# Altium project ECE453-F22-MCU.PrjPcb (part 1 of 2)
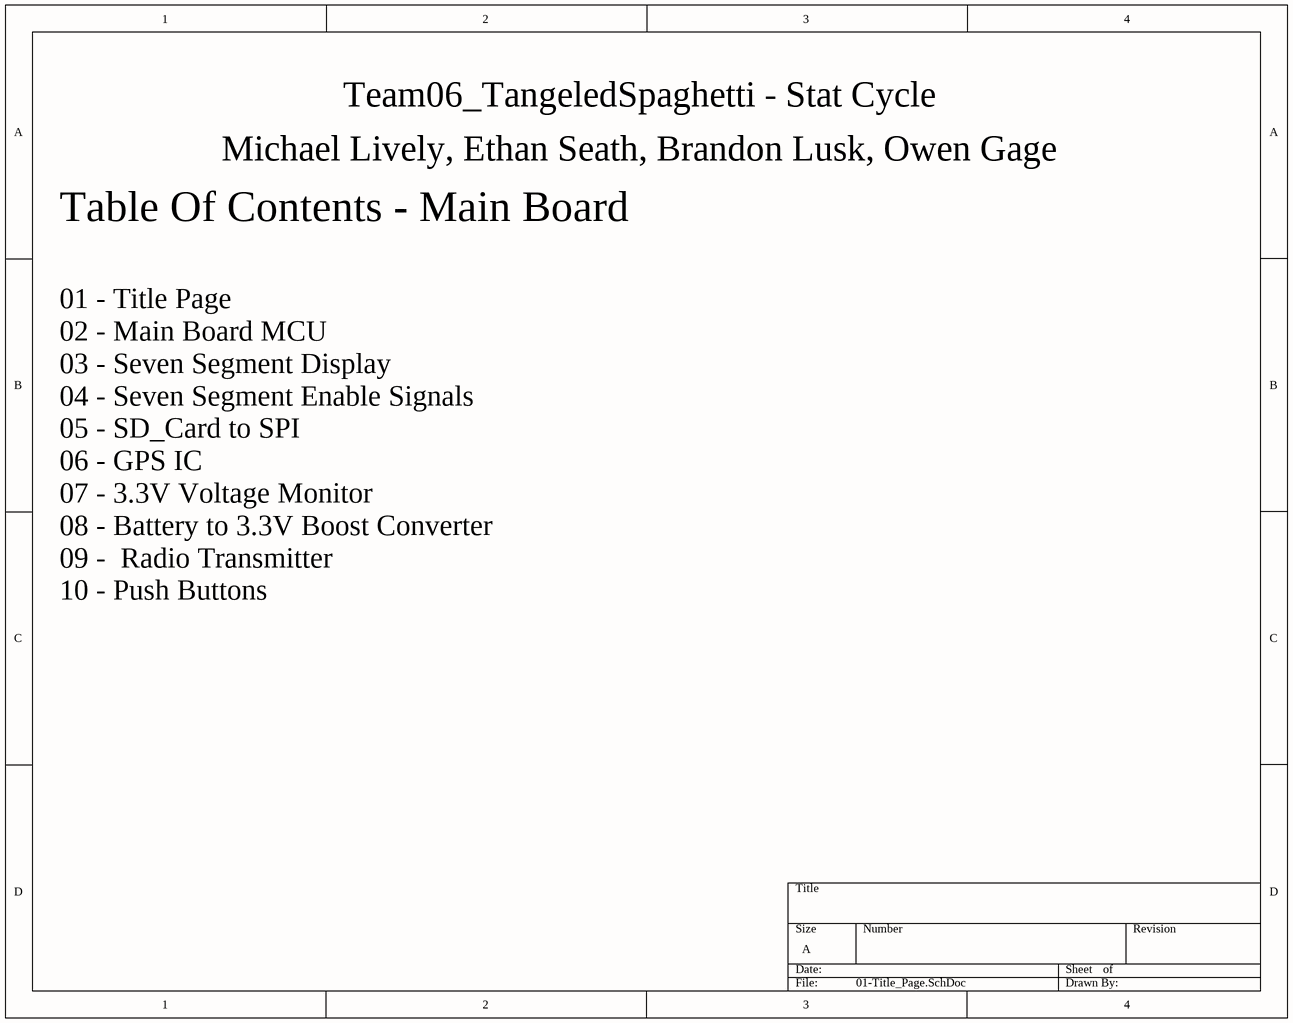
[diagram p0: 01-Title_Page.SchDoc]
10 sheets, 118 parts. Net scope: global (net labels, ports and power ports of the same name join across sheets).
Board files: ECE453_Custom.PcbDoc, TX.PcbDoc, RX.PcbDoc
Sheets:
  01-Title_Page.SchDoc
  02-MCU.SchDoc
  03_Seven_Seg.SchDoc
  04_Seven_Seg.SchDoc
  05-SD_Card.SchDoc
  06-GPS.SchDoc
  07-3V3_Monitor.SchDoc
  08-Power_3V3.SchDoc
  09-Transmitter.SchDoc
  10-Push_Buttons.SchDoc

## Sheet 01-Title_Page.SchDoc
size A; SheetNumber: 1; SheetTotal: 10

### Notes on the sheet
- Team06_TangeledSpaghetti - Stat Cycle
- Michael Lively, Ethan Seath, Brandon Lusk, Owen Gage
- Table Of Contents - Main Board
- 01 - Title Page
  02 - Main Board MCU
  03 - Seven Segment Display
  04 - Seven Segment Enable Signals
  05 - SD_Card to SPI
  06 - GPS IC
  07 - 3.3V Voltage Monitor
  08 - Battery to 3.3V Boost Converter
  09 -  Radio Transmitter
  10 - Push Buttons

## Sheet 02-MCU.SchDoc: ECE453 Power
size A; Date: 4/25/2017; ApprovedBy: JSK; CheckedBy: JSK; Author: JSK; CompanyName: University of Wisconsin; DrawnBy: JSK; Engineer: JSK; Organization: ECE 315; Address1: College of Engineering; Address2: 1415 Engineering Drive; Address3: Madison, WI 53706; Address4: ECE 453 Fall 2022; Revision: A; SheetNumber: 2; SheetTotal: 10; AssemblyNumber: ECE453-F22-01
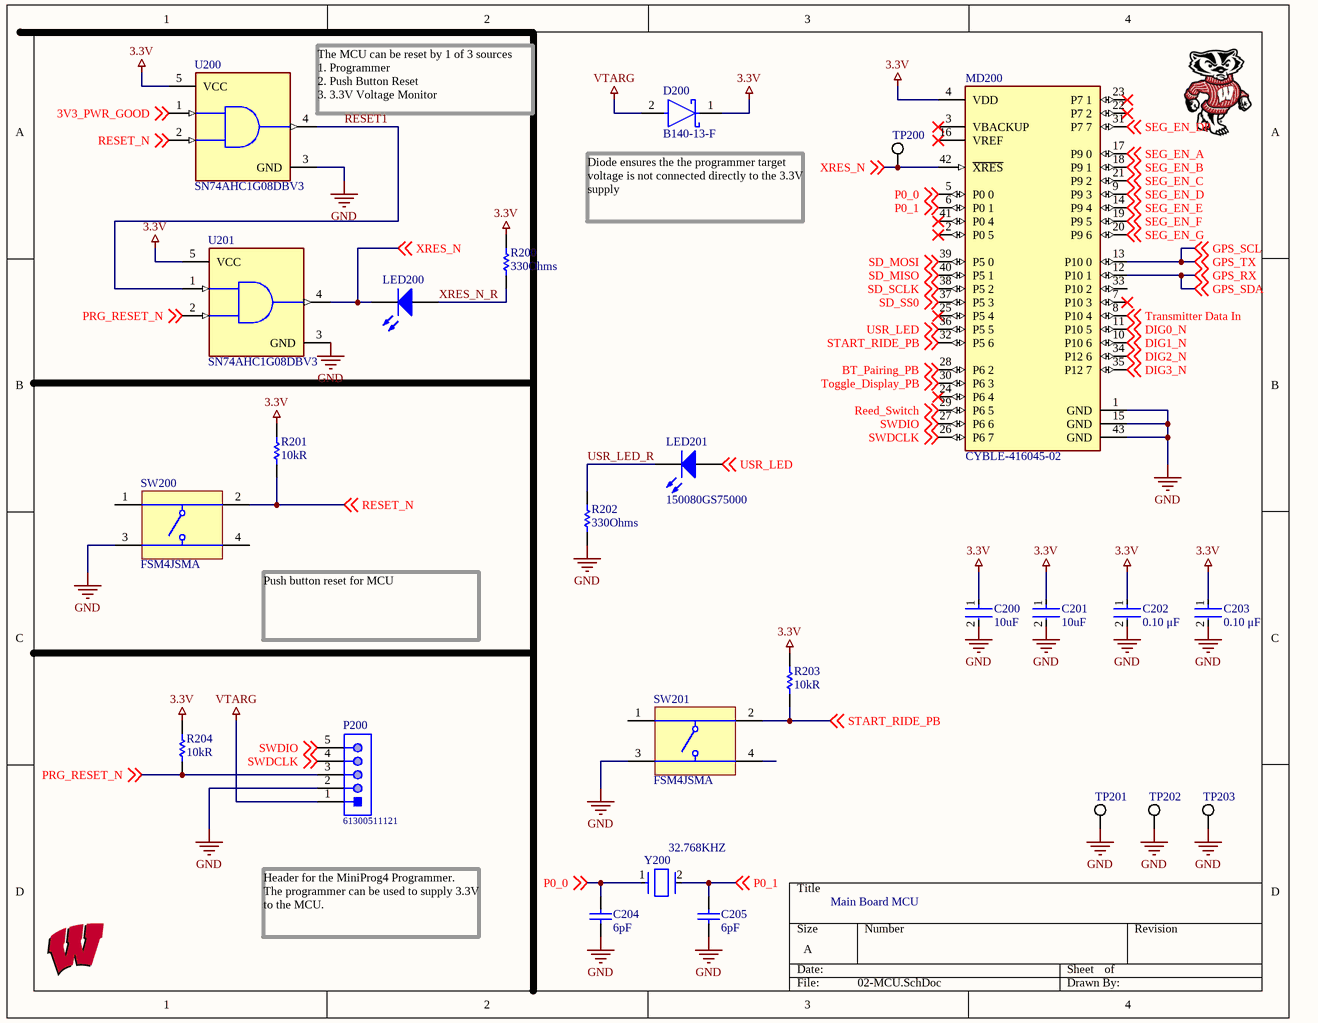
[diagram p1: 02-MCU.SchDoc]

### Parts
C200  value 10uF  [FP-C0805C-DG-MFG]  (hidden comment: C0805C106K8PACTU)
C201  value 10uF  [FP-C0805C-DG-MFG]  (hidden comment: C0805C106K8PACTU)
C202  value 0.10 μF  [FP-C0805C-DN-MFG]  (hidden comment: C0805C104K5RACTU)
C203  value 0.10 μF  [FP-C0805C-DN-MFG]  (hidden comment: C0805C104K5RACTU)
C204  Capacitance: 6pF  [CAPC2013X94X50LL20T25]  (hidden comment: 08055A6R0CAT2A)
C205  Capacitance: 6pF  [CAPC2013X94X50LL20T25]  (hidden comment: 08055A6R0CAT2A)
D200  B140-13-F  [FP-SMA-MFG]
LED200  150080RS75000  [0805_A]  (value not drawn)
LED201  150080GS75000  [0805_A]
MD200  CYBLE-416045-02  [FP-CYBLE-416045-02-MFG]
P200  61300511121  [61300511121]
R200  Resistance: 330Ohms  [RESC2013X60X35LL10T20]  (hidden comment: RC0805FR-07330RL)
R201  Resistance: 10kR  [RESC2013X60X35NL10T20]  (hidden comment: RC0805FR-0710KL)
R202  Resistance: 330Ohms  [RESC2013X60X35LL10T20]  (hidden comment: RC0805FR-07330RL)
R203  Resistance: 10kR  [RESC2013X60X35NL10T20]  (hidden comment: RC0805FR-0710KL)
R204  Resistance: 10kR  [RESC2013X60X35NL10T20]  (hidden comment: RC0805FR-0710KL)
SW200  FSM4JSMA  [TECO-FSM4JSMA_V]
SW201  FSM4JSMA  [TECO-FSM4JSMA_V]
TP200  5019  [KSTN-5019_V]  (value not drawn)
TP201  5019  [KSTN-5019_V]  (value not drawn)
TP202  5019  [KSTN-5019_V]  (value not drawn)
TP203  5019  [KSTN-5019_V]  (value not drawn)
U200  SN74AHC1G08DBV3  [FP-DBV0005A-IPC_C]
U201  SN74AHC1G08DBV3  [FP-DBV0005A-IPC_C]
Y200  32.768KHZ  [FP-ABS07-120-MFG]

### Nets
3.3V: C200.1 C201.1 C202.1 C203.1 D200.1(C) MD200.4(VDD) R200.2 R201.2 R203.2 R204.2 U200.5(VCC) U201.5(VCC)
GND: C200.2 C201.2 C202.2 C203.2 C204.1 C205.1 MD200.1(GND) MD200.15(GND) MD200.43(GND) P200.2 R202.1 SW200.3 SW201.3 TP201.1 TP202.1 TP203.1 U200.3(GND) U201.3(GND)
VTARG: D200.2(A) P200.1
3V3_PWR_GOOD: U200.1(A) ; off-sheet 3V3_PWR_GOOD
BT_Pairing_PB: MD200.28(P6_2) ; off-sheet BT_Pairing_PB
DIG0_N: MD200.11(P10_5) ; off-sheet DIG0_N
DIG1_N: MD200.10(P10_6) ; off-sheet DIG1_N
DIG2_N: MD200.34(P12_6) ; off-sheet DIG2_N
DIG3_N: MD200.35(P12_7) ; off-sheet DIG3_N
GPS_RX: MD200.12(P10_1) ; off-sheet GPS_SDA, off-sheet GPS_RX  [also labelled GPS_SDA]
GPS_SCL: MD200.13(P10_0) ; off-sheet GPS_SCL, off-sheet GPS_TX  [also labelled GPS_TX]
P0_0: C204.2 MD200.5(P0_0) Y200.1 ; off-sheet P0_0
P0_1: C205.2 MD200.6(P0_1) Y200.2 ; off-sheet P0_1
PRG_RESET_N: P200.3 R204.1 U201.2(B) ; off-sheet PRG_RESET_N
Reed_Switch: MD200.29(P6_5) ; off-sheet Reed_Switch
RESET1: U200.4(Y) U201.1(A)
RESET_N: R201.1 SW200.2 U200.2(B) ; off-sheet RESET_N
SD_MISO: MD200.40(P5_1) ; off-sheet SD_MISO  [project net MISO]
SD_MOSI: MD200.39(P5_0) ; off-sheet SD_MOSI  [project net MOSI]
SD_SCLK: MD200.38(P5_2) ; off-sheet SD_SCLK  [project net SCLK]
SD_SS0: MD200.37(P5_3) ; off-sheet SD_SS0  [project net SS0]
SEG_EN_A: MD200.17(P9_0) ; off-sheet SEG_EN_A
SEG_EN_B: MD200.18(P9_1) ; off-sheet SEG_EN_B
SEG_EN_C: MD200.21(P9_2) ; off-sheet SEG_EN_C
SEG_EN_D: MD200.9(P9_3) ; off-sheet SEG_EN_D
SEG_EN_DP: MD200.31(P7_7) ; off-sheet SEG_EN_DP
SEG_EN_E: MD200.14(P9_4) ; off-sheet SEG_EN_E
SEG_EN_F: MD200.19(P9_5) ; off-sheet SEG_EN_F
SEG_EN_G: MD200.20(P9_6) ; off-sheet SEG_EN_G
START_RIDE_PB: MD200.32(P5_6) R203.1 SW201.2 ; off-sheet START_RIDE_PB
SWDCLK: MD200.26(P6_7) P200.4 ; off-sheet SWDCLK
SWDIO: MD200.27(P6_6) P200.5 ; off-sheet SWDIO
Toggle_Display_PB: MD200.30(P6_3) ; off-sheet Toggle_Display_PB
Transmitter Data In: MD200.8(P10_4) ; off-sheet Transmitter Data In  [project net ASK]
USR_LED: LED201.2(A) MD200.36(P5_5) ; off-sheet USR_LED
USR_LED_R: LED201.1(K) R202.2
XRES_N: LED200.1(K) MD200.42(~{XRES}) TP200.1 U201.4(Y) ; off-sheet XRES_N  [project net RESET]
XRES_N_R: LED200.2(A) R200.1

Not connected (* = marked no-connect by the designer): MD200 2(P0_5)* 3(VBACKUP)* 7(P10_3)* 16(VREF)* 22(P7_2)* 23(P7_1)* 24(P6_4)* 25(P5_4)* 33(P10_2) 41(P0_4)*; SW200 1 4; SW201 1 4

### Notes on the sheet
- (near U200) The MCU can be reset by 1 of 3 sources
  1. Programmer
  2. Push Button Reset
  3. 3.3V Voltage Monitor
- (near D200) Diode ensures the the programmer target voltage is not connected directly to the 3.3V supply
- (near SW200) Push button reset for MCU
- Main Board MCU
- Header for the MiniProg4 Programmer.  The programmer can be used to supply 3.3V to the MCU.

### Library data of the parts
C200 C201 = CMP-2007-03243-2: CAP CER 10UF 10V X5R 0805; Manufacturer: Kemet; 3DS Part Number: 220-00001; Tolerance: 10%; Temperature Coefficient: 15%; Material: Ceramic; Device Class L2: Capacitors; Device Class L1: Passive Components; ComponentLink2URL: https://content.kemet.com/datasheets/KEM_C1006_X5R_SMD.pdf; Height: 1.4mm; Lead Free: Yes; Manufacturer Part Number: C0805C106K8PACTU; Digikey Description: CAP CER 10UF 10V X5R 0805; Octopart: https://octopart.com/c0805c106k8pactu-kemet-98697; Capacitance: 10uF; Temperature Range Low: -55°C; Temperature: -55°C to +85°C; Automotive: No; Mouser Description: CAP CER 10UF 10V X5R 0805; Ipc Land Pattern Name: CAPC200125X125; Temperature Range High: +85°C; Voltage: 10V; RoHS: TRUE; Device Class L3: Ceramic Capacitors; ComponentLink2Description: Datasheet; Voltage Rating: 10V; Package: C0805C-DG; Temperature Characteristic: X5R; Category: Cap; Supplier 1: Digi-Key; Supplier Part Number 1: 399-C0805C106K8PAC7800CT-ND; Manufacturer 1: KEMET; Manufacturer Part Number 1: C0805C106K8PACTU; Stock 1: 8631846; Pricing 1: 1=0.14000, 10=0.10300, 50=0.05840, 100=0.04830, 500=0.03388, 1000=0.02805 (USD); Mount: Surface Mount; Case/Package: 0805; Number of Pins: 2; Case Code (Imperial): 0805; Case Code (Metric): 2012; Dielectric Material: Ceramic; Contact Plating: Tin,Matte; Min Operating Temperature: -55°C; Max Operating Temperature: 85°C; Packaging: Tape and Reel; Dielectric: X5R; Package Quantity: 1; Voltage Rating (DC): 10V; Series: C; Termination: SMD/SMT; Construction: Flat; Dissipation Factor: 10%; Length: 2mm; Width: 1.2mm; Depth: 1.25mm; Thickness: 0.055inch; Radiation Hardening: No; REACH SVHC: No SVHC; RoHS Compliant: Yes
C202 C203 = CMP-2007-00279-2: CAP CER 0.1UF 50V X7R 0805; Manufacturer: KEMET; Tolerance: 0.1; Temperature Coefficient: 30ppm/°C; Material: Ceramic; Voltage: 500V; Manufacturer Part Number: C0805C104K5RACTU; Device Class L2: Capacitors; Temperature Range Low: -55°C; Voltage Rating: 50 V; Digikey Description: CAP CER 0.1UF 50V X7R 0805; Category: Cap; ComponentLink2Description: Datasheet; Octopart: https://octopart.com/c0805c104k5ractu-kemet-143926; RoHS: TRUE; ComponentLink2URL: https://content.kemet.com/datasheets/KEM_C1003_C0G_SMD.pdf; Temperature Characteristic: X7R; Temperature: -55°C to +125°C; Height: 0.88mm; Temperature Range High: +125°C; Device Class L1: Passive Components; Automotive: No; Lead Free: Yes; Ipc Land Pattern Name: CAPC200125X78; Device Class L3: Ceramic Capacitors; Mouser Description: Cap Ceramic 0.1uF 50V X7R 10% SMD 2.0 x 1.2 mm 125 C Paper T/R; Capacitance: 0.10 μF; Package: C0805C-DN; Supplier 1: Digi-Key; Supplier Part Number 1: 399-C0805C104K5RAC7800CT-ND; Manufacturer 1: KEMET; Manufacturer Part Number 1: C0805C104K5RACTU; Stock 1: 2903712; Pricing 1: 1=0.14000, 10=0.09700, 50=0.05480, 100=0.04540, 500=0.03182, 1000=0.02634 (USD); Mount: Surface Mount,PCB; Case/Package: 0805; Number of Pins: 2; Case Code (Imperial): 0805; Case Code (Metric): 2012; Dielectric Material: Ceramic; Contact Plating: Tin,Matte; Min Operating Temperature: -55°C; Max Operating Temperature: 125°C; Package Quantity: 4000; Packaging: Tape and Reel; Dielectric: X7R; Voltage Rating (DC): 50V; Termination: SMD/SMT; Series: C0805C; Construction: Flat; Length: 2mm; Width: 1.2mm; Depth: 1.25mm; Thickness: 0.035inch; Lead Pitch: 0.75mm; Radiation Hardening: No; RoHS Compliant: Yes; REACH SVHC: No SVHC
C204 C205 = CMP-2007-04344-1: Manufacturer: AVX Interconnect / Elco; Manufacturer 1: Kyocera AVX; Voltage Rating: 50V; Dielectric: C0G; Part Number: 08055A6R0CAT2A; Supplier 1: Digi-Key; Supplier Part Number 1: 478-11894-1-ND; Manufacturer Part Number 1: 08055A6R0CAT2A; RoHS: Yes; Category: Ceramic Capacitors; Stock 1: 19844; Pricing 1: 1=0.24000, 10=0.16700, 50=0.10000, 100=0.08440, 500=0.05778, 1000=0.05111 (USD); Mount: Surface Mount; Case/Package: 0805; Case Code (Metric): 2012; Case Code (Imperial): 0805; Min Operating Temperature: -55°C; Max Operating Temperature: 125°C; Package Quantity: 4000; Packaging: Tape and Reel; Voltage Rating (DC): 50V; Termination: SMD/SMT; Series: -; Construction: Flat; Length: 2.01mm; Width: 0.049inch; Thickness: 0.037inch; Depth: 1.25mm; Radiation Hardening: No; RoHS Compliant: Yes; ComponentLink1URL: https://datasheet.ciiva.com/205/ccog-205395.pdf?src-supplier=Digi-Key; ComponentLink1Description: https://datasheet.ciiva.com/205/ccog-205395.pdf?src-supplier=Digi-Key; ComponentLink2URL: https://datasheet.ciiva.com/11499/ccog-11499893.pdf?src-supplier=Avnet; ComponentLink2Description: https://datasheet.ciiva.com/11499/ccog-11499893.pdf?src-supplier=Avnet; ComponentLink3URL: https://datasheet.ciiva.com/5424/ccog-5424575.pdf?src-supplier=Mouser; ComponentLink3Description: https://datasheet.ciiva.com/5424/ccog-5424575.pdf?src-supplier=Mouser
D200 = CMP-2000-05096-2: DIODE SCHOTTKY 40V 1A SMA; Manufacturer 1: Diodes; Element Configuration: Single; Capacitance: 110pF; Forward Voltage: 500mV; Max Forward Surge Current (Ifsm): 30A; Max Reverse Current: 500uA; Polarity: Standard; Package Quantity: 5000; Average Rectified Current: 1A; Height: 2.1mm; Max Operating Temperature: 150°C; Radiation Hardening: No; Mount: Surface Mount; REACH SVHC: No SVHC; Contact Plating: Tin; Width: 2.92mm; RoHS Compliant: Yes; Max Repetitive Reverse Voltage (Vrrm): 40V; Current Rating: 1A; Termination: SMD/SMT; Number of Pins: 2; Max Reverse Voltage (DC): 40V; Series: B140; Length: 4.6mm; Forward Current: 1A; Voltage Rating (DC): 40V; Lead Free: Lead Free; Weight: 0.004233oz; Output Current: 1A; Case/Package: SMA; Min Operating Temperature: -65°C; Packaging: Cut Tape; Peak Non-Repetitive Surge Current: 30A; Supplier 1: Digi-Key; Supplier Part Number 1: B140-FDICT-ND; Manufacturer Part Number 1: B140-13-F; RoHS: Yes; Category: Rectifier Diodes; Stock 1: 157255; Pricing 1: 1=0.41000, 10=0.33200, 100=0.17600, 500=0.11576, 1000=0.07872, 2000=0.07100 (USD); ComponentLink1URL: https://datasheet.ciiva.com/15220/getdatasheetpartid-115924-15220197.pdf?src-supplier=Verical; ComponentLink1Description: https://datasheet.ciiva.com/15220/getdatasheetpartid-115924-15220197.pdf?src-supplier=Verical; ComponentLink2URL: https://datasheet.ciiva.com/912/ds13002-912361.pdf?src-supplier=Digi-Key; ComponentLink2Description: https://datasheet.ciiva.com/912/ds13002-912361.pdf?src-supplier=Digi-Key; ComponentLink3URL: https://datasheet.ciiva.com/912/ds13002-912362.pdf?src-supplier=Digi-Key; ComponentLink3Description: https://datasheet.ciiva.com/912/ds13002-912362.pdf?src-supplier=Digi-Key; ComponentLink4URL: https://datasheet.ciiva.com/912/ds13002-912360.pdf?src-supplier=Digi-Key; ComponentLink4Description: https://datasheet.ciiva.com/912/ds13002-912360.pdf?src-supplier=Digi-Key
LED200 = CMP-1426-00011-1: SMD mono-color Chip LED, WL-SMCW, Red; Manufacturer: Wuerth Elektronik; Manufacturer 1: Wurth Electronics; Luminous Intensity: 150mcd; Viewing Angle: 140°; Forward Voltage: 2V; Lens Style: Clear,Rectangular; Forward Current: 30mA; Dominant Wavelength: 625nm; Test Current: 20mA; Color: Red; PartNumber: 150080RS75000; PackageReference: 0805_A; ComponentLink2Description: Datasheet; ComponentLink1URL: http://www.we-online.com; ComponentLink1Description: Manufacturer URL; ComponentLink2URL: http://katalog.we-online.com/led/datasheet/150080RS75000.pdf; Supplier 1: Digi-Key; Supplier Part Number 1: 732-4984-1-ND; Manufacturer Part Number 1: 150080RS75000; RoHS: Yes; Category: LEDs; Stock 1: 100282; Pricing 1: 1=0.19000, 50=0.17600, 100=0.15100, 500=0.13100 (USD); Mount: Surface Mount; Case/Package: 0805; Case Code (Metric): 2012; Case Code (Imperial): 0805; Min Operating Temperature: -40°C; Max Operating Temperature: 85°C; Packaging: Tape and Reel; Wavelength: 625nm; Package Quantity: 4000; Length: 2mm; Width: 1.25mm; Height: 0.7mm; RoHS Compliant: Yes; REACH SVHC: Unknown; ComponentLink3URL: https://datasheet.ciiva.com/22656/150080rs75000-22656961.pdf?src-supplier=Element14; ComponentLink3Description: https://datasheet.ciiva.com/22656/150080rs75000-22656961.pdf?src-supplier=Element14; ComponentLink4URL: https://datasheet.ciiva.com/29279/759435-da-01-en-chipled-0805-w-kl-rot-150080rs75000-29279032.pdf?src-supplier=Conrad; ComponentLink4Description: https://datasheet.ciiva.com/29279/759435-da-01-en-chipled-0805-w-kl-rot-150080rs75000-29279032.pdf?src-supplier=Conrad
LED201 = CMP-1426-00007-1: SMD mono-color Chip LED, WL-SMCW, Green; Manufacturer: Wuerth Elektronik; Manufacturer 1: Wurth Electronics; Viewing Angle: 140°; Lens Style: Clear,Rectangular; Luminous Intensity: 450mcd; Forward Voltage: 3.2V; Wavelength: 520nm; Forward Current: 30mA; Test Current: 20mA; PackageReference: 0805_A; Color: Green; PartNumber: 150080GS75000; ComponentLink2URL: http://katalog.we-online.com/led/datasheet/150080GS75000.pdf; ComponentLink1URL: http://www.we-online.com; ComponentLink1Description: Manufacturer URL; ComponentLink2Description: Datasheet; Supplier 1: Digi-Key; Supplier Part Number 1: 732-4983-1-ND; Manufacturer Part Number 1: 150080GS75000; RoHS: Yes; Category: LEDs; Stock 1: 95801; Pricing 1: 1=0.19000, 50=0.17600, 100=0.15100, 500=0.13100 (USD); Mount: Surface Mount; Case/Package: 0805; Case Code (Metric): 2012; Case Code (Imperial): 0805; Min Operating Temperature: -40°C; Max Operating Temperature: 85°C; Package Quantity: 4000; Packaging: Cut Tape; Dominant Wavelength: 520nm; Length: 2mm; Width: 1.25mm; Height: 0.7mm; REACH SVHC: Unknown; RoHS Compliant: Yes; ComponentLink3URL: https://datasheet.ciiva.com/29563/150080gs75000-29563008.pdf?src-supplier=Digi-Key; ComponentLink3Description: https://datasheet.ciiva.com/29563/150080gs75000-29563008.pdf?src-supplier=Digi-Key; ComponentLink4URL: https://datasheet.ciiva.com/29279/759434-da-01-en-chipled-0805-w-kl-gruen-150080gs75000-29279039.pdf?src-supplier=Conrad; ComponentLink4Description: https://datasheet.ciiva.com/29279/759434-da-01-en-chipled-0805-w-kl-gruen-150080gs75000-29279039.pdf?src-supplier=Conrad
MD200 = CMP-12964-000002-1: RF TXRX MOD BLUETOOTH TRACE ANT; Manufacturer: Cypress Semiconductor; Manufacturer 1: Cypress; Number Of Gpio: 36; Number Of Adc Channels: 1; Max Supply Voltage: 3.6V; Min Supply Voltage: 1.71V; Data Rate: 2Mbits/s; Receiving Current: 6.7mA; Max Frequency: 2.5GHz; Bandwidth: 100MHz; Transmitting Current: 5.7mA; Interface: I2C,SPI,UART,I2S,Other; Octopart: https://octopart.com/cyble-416045-02-cypress+semiconductor-96386825; Lead Free: Yes; RoHS: TRUE; Device Class L3: Transceivers; Category: UNK; Package: 0; Device Class L2: RF Semiconductors and Devices; Automotive: No; ComponentLink2URL: https://www.cypress.com/file/428336/download; Temperature Range Low: -40°C; Height: 2mm; Device Class L1: Integrated Circuits (ICs); Manufacturer Part Number: CYBLE-416045-02; ComponentLink2Description: Datasheet; Digikey Description: RF TXRX MOD BLUETOOTH TRACE ANT; Temperature: -40°C to +85°C; Temperature Range High: +85°C; Supplier 1: Digi-Key; Supplier Part Number 1: 428-4622-1-ND; Manufacturer Part Number 1: CYBLE-416045-02; Stock 1: 3441; Pricing 1: 1=16.24000, 10=14.69300, 25=13.53280, 100=12.37280, 250=11.59952 (USD); RoHS Compliant: Yes
P200 = CMP-1502-01068-1: THT Vertical Pin Header WR-PHD, Pitch 2.54 mm, Single Row, 5 pins; Manufacturer: Wurth Elektronik; Manufacturer 1: Wurth Electronics; Pin Number: 5; Contact Resistance: 20mOhm; Working Voltage: 250VAC; Pitch: 2.54mm; Withstanding Voltage: 500VAC; Rated Current: 3A; Gender: Male; Connector Type: Male Pin; Datasheet URL: https://katalog.we-online.de/em/datasheet/6130xx11121.pdf; Orientation: Vertical; Mounting Technology: THT; Row Number: Single; Package Reference: 61300511121; Publisher: WurthElektronik; Part Number: 61300511121; Packaging: Bag; Manufacturer URL: http://www.we-online.de; Operating Temperature: -40to105degC; Supplier 1: Digi-Key; Supplier Part Number 1: 732-5318-ND; Manufacturer Part Number 1: 61300511121; RoHS: Yes; Category: Headers and Wire Housings; Stock 1: 41302; Pricing 1: 1=0.26000, 10=0.22200, 25=0.18520, 50=0.15500, 100=0.14100, 1000=0.12800 (USD); Mount: Through Hole; Contact Plating: Gold; Contact Material: Copper; Color: Black; Number of Rows: 1; Termination: Solder; Number of Contacts: 5; Number of Positions: 5; Contact Mating Length: 0.236inch; RoHS Compliant: Yes; REACH SVHC: Unknown; Lead Free: Lead Free; ComponentLink1URL: http://www.farnell.com/cad/1737268.pdf?src-supplier=Element14; ComponentLink1Description: http://www.farnell.com/cad/1737268.pdf?src-supplier=Element14; ComponentLink2URL: https://katalog.we-online.de/em/datasheet/6130xx11121.pdf?src-supplier=Digi-Key; ComponentLink2Description: https://katalog.we-online.de/em/datasheet/6130xx11121.pdf?src-supplier=Digi-Key
R200 R202 = CMP-2000-06960-1: Chip Resistor, 330 Ohm, +/- 1%, 125 mW, -55 to 155 degC, 0805 (2012 Metric), RoHS, Tape and Reel; Manufacturer: Yageo; Voltage Rating: 150V; Temperature Coefficient: 100PPM/C; Power Rating: 125mW(1/8W); Max Power Dissipation: 125mW; Datasheet Version: Rev. 7, 05/2017; Termination Style: SMD/SMT; Case Code - mm: 2012; Package Description: 2-Pin Surface Mounted Device, Body 2 x 1.25 mm; Operating Temperature Range: -55Cto+155C; Case Code - in: 0805; Packaging: Reel; Tolerance: 1%; Package Reference: 0805; Mounting Technology: SurfaceMount; Product: ThickFilmResistorsGeneralPurpose; Series: RC; Manufacturer URL: http://www.yageo.com/; Datasheet URL: http://www.yageo.com/documents/recent/PYu-RC_Group_51_RoHS_L_7.pdf; Supplier 1: Digi-Key; Supplier Part Number 1: 311-330CRCT-ND; Manufacturer 1: Yageo; Manufacturer Part Number 1: RC0805FR-07330RL; RoHS: Yes; Category: Chip SMD Resistors; Stock 1: 1406392; Pricing 1: 1=0.10000, 10=0.03800, 100=0.01560, 1000=0.00699, 2500=0.00607 (USD); Case/Package: 0805; Case Code (Imperial): 0805; Case Code (Metric): 2012; Size Code: 0805; Min Operating Temperature: -55°C; Max Operating Temperature: 155°C; Package Quantity: 5000; Construction: Rectangular; Resistor Type: Thick Film; Number of Terminations: 2; Termination: SMD/SMT; Features: Moisture Resistant; Resistance Tolerance: 1%; Length: 2mm; Width: 0.049inch; Height: 0.024inch; Depth: 1.25mm; RoHS Compliant: Yes; Military Standard: Not; REACH SVHC: Unknown; Lead Free: Lead Free; ComponentLink1URL: https://datasheet.ciiva.com/2457/pyu-r-int-thick-7-2457015.pdf?src-supplier=Digi-Key; ComponentLink1Description: https://datasheet.ciiva.com/2457/pyu-r-int-thick-7-2457015.pdf?src-supplier=Digi-Key; ComponentLink2URL: https://datasheet.ciiva.com/2457/pyu-r-int-thick-7-2457016.pdf?src-supplier=Digi-Key; ComponentLink2Description: https://datasheet.ciiva.com/2457/pyu-r-int-thick-7-2457016.pdf?src-supplier=Digi-Key; ComponentLink3URL: https://datasheet.ciiva.com/2457/pyu-r-int-thick-7-2457014.pdf?src-supplier=Digi-Key; ComponentLink3Description: https://datasheet.ciiva.com/2457/pyu-r-int-thick-7-2457014.pdf?src-supplier=Digi-Key; ComponentLink4URL: https://datasheet.ciiva.com/12667/rc0805-12667925.pdf?src-supplier=Mouser; ComponentLink4Description: https://datasheet.ciiva.com/12667/rc0805-12667925.pdf?src-supplier=Mouser; ComponentLink5URL: https://datasheet.ciiva.com/7941/444164-7941768.pdf?src-supplier=Element14; ComponentLink5Description: https://datasheet.ciiva.com/7941/444164-7941768.pdf?src-supplier=Element14; ComponentLink6URL: https://datasheet.ciiva.com/7941/444164-7941769.pdf?src-supplier=Element14; ComponentLink6Description: https://datasheet.ciiva.com/7941/444164-7941769.pdf?src-supplier=Element14; ComponentLink7URL: https://datasheet.ciiva.com/16740/rc0805-16740975.pdf?src-supplier=Future+Electronics; ComponentLink7Description: https://datasheet.ciiva.com/16740/rc0805-16740975.pdf?src-supplier=Future+Electronics
R201 R203 R204 = CMP-1659-00013-4: Chip Resistor, 10 KOhm, +/- 1%, 0.125 W, -55 to 155 degC, 0805 (2012 Metric), RoHS, Tape and Reel; Manufacturer: Yageo; Voltage Rating: 150 V; Temperature Coefficient: 100ppm/°C; Power Rating: 125mW; Mount: Surface Mount; ComponentLink1Description: Manufacturer URL; ComponentLink2URL: http://www.yageo.com/documents/recent/PYu-RC_Group_51_RoHS_L_04.pdf; Pins: 2; Length: 2 mm; Min Operating Temperature: -55 degC; Height: 0.5 mm; Mounting Technology: Surface Mount; RoHSCompliant: true; REACH SVHC: No SVHC; ComponentLink1URL: http://www.yageo.com/; Max Operating Temperature: 155 degC; PackageReference: 0805; DatasheetVersion: Rev. 4, 02/2016; Package Quantity: 5000; Packaging: Tape and Reel; ComponentLink2Description: Datasheet; PackageDescription: 2-Pin Surface Mounted Device, Body 2 x 1.25 mm; Supplier 1: Digi-Key; Supplier Part Number 1: 311-10.0KCRCT-ND; Manufacturer 1: Yageo; Manufacturer Part Number 1: RC0805FR-0710KL; RoHS: Yes; Category: Chip SMD Resistors; Stock 1: 5682818; Pricing 1: 1=0.10000, 10=0.03800, 100=0.01560, 1000=0.00702, 2500=0.00610 (USD); Case/Package: 0805; Case Code (Imperial): 0805; Case Code (Metric): 2012; Size Code: 0805; Tolerance: 1%; Resistor Type: Thick Film; Series: RC; Number of Terminations: 2; Max Power Dissipation: 125mW; Termination: SMD/SMT; Features: Moisture Resistant; Construction: Rectangular; Resistance Tolerance: 1%; Technology: THICK FILM; Width: 0.049inch; Depth: 1.25mm; RoHS Compliant: Yes; Military Standard: Not; Lead Free: Lead Free; ComponentLink3URL: https://datasheet.ciiva.com/11808/0900766b8106beab-11808151.pdf?src-supplier=RSComponents; ComponentLink3Description: https://datasheet.ciiva.com/11808/0900766b8106beab-11808151.pdf?src-supplier=RSComponents; ComponentLink4URL: https://datasheet.ciiva.com/46447/444164-46447563.pdf?src-supplier=Element14; ComponentLink4Description: https://datasheet.ciiva.com/46447/444164-46447563.pdf?src-supplier=Element14; ComponentLink5URL: https://datasheet.ciiva.com/2456/pyu-r-int-thick-7-2456973.pdf?src-supplier=Digi-Key; ComponentLink5Description: https://datasheet.ciiva.com/2456/pyu-r-int-thick-7-2456973.pdf?src-supplier=Digi-Key; ComponentLink6URL: https://datasheet.ciiva.com/2456/pyu-r-int-thick-7-2456974.pdf?src-supplier=Digi-Key; ComponentLink6Description: https://datasheet.ciiva.com/2456/pyu-r-int-thick-7-2456974.pdf?src-supplier=Digi-Key; ComponentLink7URL: https://datasheet.ciiva.com/2456/pyu-r-int-thick-7-2456972.pdf?src-supplier=Digi-Key; ComponentLink7Description: https://datasheet.ciiva.com/2456/pyu-r-int-thick-7-2456972.pdf?src-supplier=Digi-Key; ComponentLink8URL: https://datasheet.ciiva.com/12669/rc0805-12669688.pdf?src-supplier=Mouser; ComponentLink8Description: https://datasheet.ciiva.com/12669/rc0805-12669688.pdf?src-supplier=Mouser; ComponentLink9URL: https://datasheet.ciiva.com/16747/rc0805-16747087.pdf?src-supplier=Future+Electronics; ComponentLink9Description: https://datasheet.ciiva.com/16747/rc0805-16747087.pdf?src-supplier=Future+Electronics
SW200 SW201 = CMP-2000-05602-2: Swicth, SPST, 24 V, -35 to 85 degC, 4-Pin SMD, RoHS, Tape and Reel; Manufacturer: TE Connectivity; Switch Travel: 0.25mm; Mechanical Life: 100000Cycles; Contact Current Rating: 50mA; Operating Force: 1.57N; Actuator Material: Polyamide; Contact Resistance: 100mOhm; Voltage Rating: 24V; Illumination Type: Illuminated; Actuator Length: 0.055inch; Max Voltage Rating (DC): 12V; Case\/Package: SMD/SMT; Switch Function: Off-Mom; Actuator Type: Standard; Insulation Resistance: 100MR; Orientation: Straight; Datasheet URL: http://www.te.com/commerce/DocumentDelivery/DDEController?Action=showdoc&DocId=Customer+Drawing%7F2-1437565-7%7FV%7Fpdf%7FEnglish%7FENG_CD_2-1437565-7_V.pdf%7F4-1437565-2; Min Operating Temperature: -35degC; Packaging: LoosePiece; Termination: GullWing; Throw Configuration: SPST; Package Description: 4-Pin Surface Mount Device, Body 6 x 6 mm, Pitch 4.5 mm; Mounting Technology: SurfaceMount; Contact Plating: Silver; Datasheet Version: Rev. V, 02/2015; RoHSCompliant: true; Max Operating Temperature: 85degC; Length: 6mm; Voltage Rating (DC): 24V; Electrical Life: 100000Cycles; Current Rating: 50mA; Package Quantity: 750; Mount: SurfaceMount; Package Reference: FSM4JSMA; Manufacturer URL: http://www.te.com/; Width: 6mm; REACH SVHC: Unknown; Contact Material: CopperAlloy; Supplier 1: Digi-Key; Supplier Part Number 1: 450-1129-ND; Manufacturer 1: TE Connectivity; Manufacturer Part Number 1: FSM4JSMA; RoHS: Yes; Category: Pushbutton Switches; Stock 1: 65608; Pricing 1: 1=0.27000, 10=0.26300, 25=0.24960, 100=0.22600, 250=0.20604, 750=0.19152, 1500=0.16339, 3000=0.15885, 5250=0.14977 (USD); Case/Package: SMD/SMT; Color: Black; Series: FSMJSMA; Max Current Rating: 50mA; Depth: 10mm; Radiation Hardening: No; RoHS Compliant: Yes; Lead Free: Lead Free; ELV: Compliant
TP200-TP203 = CMP-1672-00008-1: Test Point, 1 Position SMD, RoHS, Tape and Reel; Manufacturer 1: Keystone Electronics; ComponentLink1Description: Manufacturer URL; Package Quantity: 1000; DatasheetVersion: 03/2014; Packaging: Tape and Reel; ComponentLink2URL: http://www.keyelco.com/product-pdf.cfm?p=1357; ComponentLink1URL: http://www.keyelco.com/; Mount: Surface Mount; Contact Plating: Silver; PackageDescription: 1-Pin Surface Mount Device, Body 3.81 x 2.03 mm; Pins: 1; RoHSCompliant: True; Mounting Technology: Surface Mount; ComponentLink2Description: Datasheet; PackageReference: 5019; Supplier 1: Digi-Key; Supplier Part Number 1: 36-5019CT-ND; Manufacturer Part Number 1: 5019; RoHS: Yes; Category: Connectors; Stock 1: 1316816; Pricing 1: 1=0.34000, 25=0.27360, 100=0.22340, 250=0.20064, 500=0.19152 (USD); Number of Pins: 1; Material: Bronze; Contact Material: Bronze; Series: 5019; Termination: SMD/SMT; Height: 0.09inch; RoHS Compliant: Yes; REACH SVHC: No SVHC; Lead Free: Lead Free; ComponentLink3URL: https://datasheet.ciiva.com/16318/m60-2p61-16318395.pdf?src-supplier=Future+Electronics; ComponentLink3Description: https://datasheet.ciiva.com/16318/m60-2p61-16318395.pdf?src-supplier=Future+Electronics; ComponentLink4URL: https://datasheet.ciiva.com/16885/70182998-16885945.pdf?src-supplier=Allied+Electronics; ComponentLink4Description: https://datasheet.ciiva.com/16885/70182998-16885945.pdf?src-supplier=Allied+Electronics; ComponentLink5URL: https://datasheet.ciiva.com/14848/m60-2p61-14848437.pdf?src-supplier=Digi-Key; ComponentLink5Description: https://datasheet.ciiva.com/14848/m60-2p61-14848437.pdf?src-supplier=Digi-Key; ComponentLink6URL: https://datasheet.ciiva.com/14848/m60-2p61-14848438.pdf?src-supplier=Digi-Key; ComponentLink6Description: https://datasheet.ciiva.com/14848/m60-2p61-14848438.pdf?src-supplier=Digi-Key; ComponentLink7URL: https://datasheet.ciiva.com/14848/m60-2p61-14848439.pdf?src-supplier=Digi-Key; ComponentLink7Description: https://datasheet.ciiva.com/14848/m60-2p61-14848439.pdf?src-supplier=Digi-Key
U200 U201 = CMP-04903-000082-1: IC GATE AND 1CH 2-INP SOT23-5; Manufacturer 1: Texas Instruments; Logic Function: AND GATE; RoHS Compliant: Yes; Supplier 1: Digi-Key; Supplier Part Number 1: 296-SN74AHC1G08DBV3CT-ND; Manufacturer Part Number 1: SN74AHC1G08DBV3; RoHS: Yes; Category: Logic Gates; Stock 1: 11940; Pricing 1: 1=0.53000, 10=0.42800, 25=0.39200, 100=0.29170, 250=0.26436, 500=0.21878, 1000=0.16409 (USD); ComponentLink1URL: http://www.ti.com/general/docs/suppproductinfo.tsp?distId=10&amp;gotoUrl=http%3A%2F%2Fwww.ti.com%2Flit%2Fgpn%2Fsn74ahc1g08&src-supplier=Digi-Key; ComponentLink1Description: http://www.ti.com/general/docs/suppproductinfo.tsp?distId=10&amp;gotoUrl=http%3A%2F%2Fwww.ti.com%2Flit%2Fgpn%2Fsn74ahc1g08&src-supplier=Digi-Key
Y200 = CMP-2000-07587-2: CRYSTAL 32.7680KHZ 6PF SMD; Manufacturer 1: Abracon; Manufacturer Part Number 1: ABS07-120-32.768KHZ-T; Frequency Tolerance: 20ppm; Series Resistance: 60kR; ESR (Equivalent Series Resistance): 55kR; Depth: 1.5mm; Width: 0.061inch; Number of Pins: 2; Max Operating Temperature: 85°C; Length: 3.2mm; Case/Package: SMD/SMT; Series: ABS07; Lead Free: Lead Free; Min Operating Temperature: -40°C; Load Capacitance: 6pF; Packaging: Tape and Reel; Height: 0.035inch; Radiation Hardening: No; Tolerance: 20ppm; Operating Frequency: 32.768 kHz; Termination: SMD/SMT; REACH SVHC: No SVHC; RoHS Compliant: Yes; Frequency: 32.768kHz; Package Quantity: 3000; Mount: Surface Mount; Supplier 1: Digi-Key; Supplier Part Number 1: 535-11937-1-ND; RoHS: Yes; Category: Crystals; Stock 1: 273340; Pricing 1: 1=1.20000, 10=1.15000, 50=1.12340, 100=0.96290, 500=0.93616, 1000=0.78905 (USD); ComponentLink1URL: https://datasheet.ciiva.com/6728/abs07-120-32-768khz-t-6728893.pdf?src-supplier=Digi-Key; ComponentLink1Description: https://datasheet.ciiva.com/6728/abs07-120-32-768khz-t-6728893.pdf?src-supplier=Digi-Key; ComponentLink2URL: https://datasheet.ciiva.com/12387/abs07-120-32-768khz-t-218607-12387629.pdf?src-supplier=Mouser; ComponentLink2Description: https://datasheet.ciiva.com/12387/abs07-120-32-768khz-t-218607-12387629.pdf?src-supplier=Mouser; ComponentLink3URL: https://datasheet.ciiva.com/15214/getdatasheetpartid-722402-15214953.pdf?src-supplier=Verical; ComponentLink3Description: https://datasheet.ciiva.com/15214/getdatasheetpartid-722402-15214953.pdf?src-supplier=Verical

## Sheet 03_Seven_Seg.SchDoc: ECE315 Analog
size A; Date: 4/25/2017; ApprovedBy: JSK; CheckedBy: JSK; Author: JSK; CompanyName: University of Wisconsin; DrawnBy: JSK; Engineer: JSK; Organization: ECE 315; Address1: College of Engineering; Address2: 1415 Engineering Drive; Address3: Madison, WI 53706; Address4: ECE 315 Fall 2017; Revision: A; SheetNumber: 3; SheetTotal: 11; AssemblyNumber: ECE315-F19; ApprovedDate: 04/02/2019
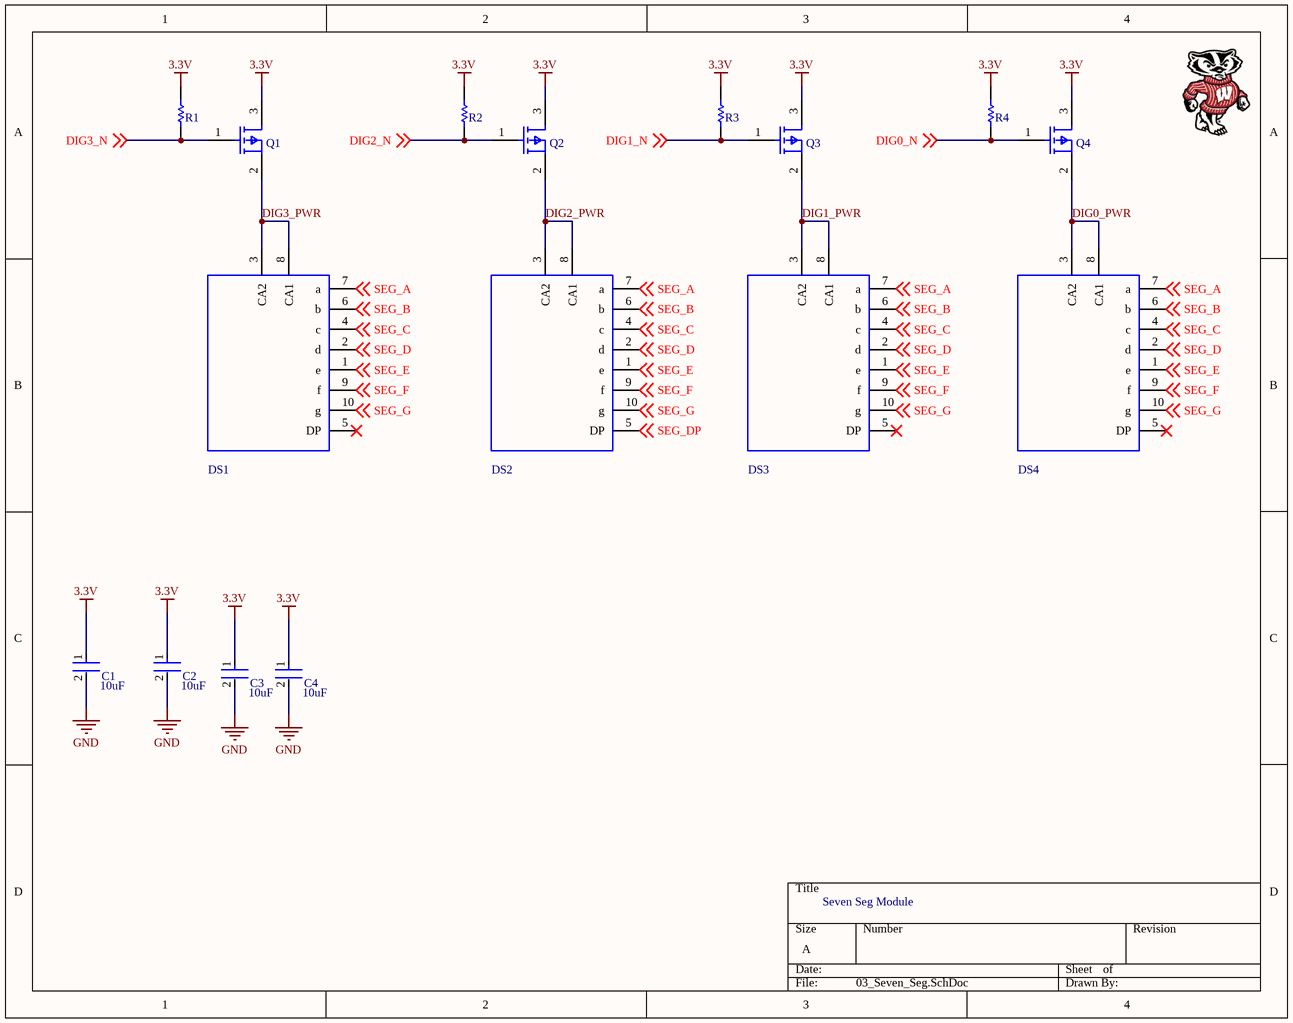
[diagram p2: 03_Seven_Seg.SchDoc]

### Parts
C1  Capacitance: 10uF  [FP-CL21-IPC_B]  (hidden comment: CL21A106KQCLNNC)
C2  Capacitance: 10uF  [FP-CL21-IPC_B]  (hidden comment: CL21A106KQCLNNC)
C3  Capacitance: 10uF  [FP-CL21-IPC_B]  (hidden comment: CL21A106KQCLNNC)
C4  Capacitance: 10uF  [FP-CL21-IPC_B]  (hidden comment: CL21A106KQCLNNC)
DS1  ACSA56-41CGKWA-F01  [ACSA56-41CGKWA-F01]  (value not drawn)
DS2  ACSA56-41CGKWA-F01  [ACSA56-41CGKWA-F01]  (value not drawn)
DS3  ACSA56-41CGKWA-F01  [ACSA56-41CGKWA-F01]  (value not drawn)
DS4  ACSA56-41CGKWA-F01  [ACSA56-41CGKWA-F01]  (value not drawn)
Q1  SSM3J133TU  [UFM_TOS]  (value not drawn)
Q2  SSM3J133TU  [UFM_TOS]  (value not drawn)
Q3  SSM3J133TU  [UFM_TOS]  (value not drawn)
Q4  SSM3J133TU  [UFM_TOS]  (value not drawn)
R1  RES_0805_K_010.00  [RES_0805]  (value not drawn)
R2  RES_0805_K_010.00  [RES_0805]  (value not drawn)
R3  RES_0805_K_010.00  [RES_0805]  (value not drawn)
R4  RES_0805_K_010.00  [RES_0805]  (value not drawn)

### Nets
3.3V: C1.1 C2.1 C3.1 C4.1 Q1.3(Drain) Q2.3(Drain) Q3.3(Drain) Q4.3(Drain) R1.2 R2.2 R3.2 R4.2
GND: C1.2 C2.2 C3.2 C4.2
DIG0_N: Q4.1(Gate) R4.1 ; off-sheet DIG0_N
DIG0_PWR: DS4.3(CA2) DS4.8(CA1) Q4.2(Source)
DIG1_N: Q3.1(Gate) R3.1 ; off-sheet DIG1_N
DIG1_PWR: DS3.3(CA2) DS3.8(CA1) Q3.2(Source)
DIG2_N: Q2.1(Gate) R2.1 ; off-sheet DIG2_N
DIG2_PWR: DS2.3(CA2) DS2.8(CA1) Q2.2(Source)
DIG3_N: Q1.1(Gate) R1.1 ; off-sheet DIG3_N
DIG3_PWR: DS1.3(CA2) DS1.8(CA1) Q1.2(Source)
SEG_A: DS1.7(a) DS2.7(a) DS3.7(a) DS4.7(a) ; off-sheet SEG_A
SEG_B: DS1.6(b) DS2.6(b) DS3.6(b) DS4.6(b) ; off-sheet SEG_B
SEG_C: DS1.4(c) DS2.4(c) DS3.4(c) DS4.4(c) ; off-sheet SEG_C
SEG_D: DS1.2(d) DS2.2(d) DS3.2(d) DS4.2(d) ; off-sheet SEG_D
SEG_DP: DS2.5(DP) ; off-sheet SEG_DP
SEG_E: DS1.1(e) DS2.1(e) DS3.1(e) DS4.1(e) ; off-sheet SEG_E
SEG_F: DS1.9(f) DS2.9(f) DS3.9(f) DS4.9(f) ; off-sheet SEG_F
SEG_G: DS1.10(g) DS2.10(g) DS3.10(g) DS4.10(g) ; off-sheet SEG_G

Not connected (* = marked no-connect by the designer): DS1 5(DP)*; DS3 5(DP)*; DS4 5(DP)*

### Notes on the sheet
- Seven Seg Module

### Library data of the parts
C1-C4 = CMP-13271-003047-1: CL21 Series 0805 10uF 6.3V ±10% Tolerance X5R Multilayer Ceramic Chip Capacitor; Lead Free: Lead Free; Mount: Surface Mount; Case/Package: 0805; Packaging: Tape and Reel; Max Operating Temperature: 85°C; Min Operating Temperature: -55°C; Voltage Rating: 6.3V; Case Code (Metric): 2012; Radiation Hardening: No; Tolerance: 10%; Package Quantity: 1; Depth: 1.25mm; Width: 0.049inch; Dielectric: X5R; Height: 0.85mm; Case Code (Imperial): 0805; Length: 2mm; Thickness: 0.037inch
DS1-DS4 = ACSA56-41CGKWA-F01: DISPLAY 0.56" SGL 574NM GRN SMD; Manufacturer 1: Kingbright; Color: Green; Power Consumption: 75mW; Number of Characters: 1; Element Configuration: Common Anode; Forward Current: 30mA; Forward Voltage: 2.1V; Wavelength: 570nm; Test Current: 20mA; Luminous Intensity: 25mcd; Display Type: Segment; Supplier 1: Digi-Key; Supplier Part Number 1: 754-1033-1-ND; Manufacturer Part Number 1: ACSA56-41CGKWA-F01; RoHS: Yes; Category: LED Displays; Stock 1: 38128; Pricing 1: 1=3.38000, 10=2.25300, 100=1.73360 (USD); Case/Package: SMD/SMT; Min Operating Temperature: -40°C; Max Operating Temperature: 85°C; Package Quantity: 400; Max Power Dissipation: 75mW; Illumination Color: Green; Packaging: Rail/Tube; Operating Supply Voltage: 2.1V; Width: 0.488inch; Height: 0.669inch; RoHS Compliant: Yes; Lead Free: Lead Free; ComponentLink1URL: https://datasheet.ciiva.com/2103/acsa56-41cgkwa-f01-2103794.pdf?src-supplier=Digi-Key; ComponentLink1Description: https://datasheet.ciiva.com/2103/acsa56-41cgkwa-f01-2103794.pdf?src-supplier=Digi-Key; ComponentLink2URL: https://datasheet.ciiva.com/4421/acsa56-41cgkwa-f01-17964-4421697.pdf?src-supplier=Mouser; ComponentLink2Description: https://datasheet.ciiva.com/4421/acsa56-41cgkwa-f01-17964-4421697.pdf?src-supplier=Mouser; ComponentLink3URL: https://datasheet.ciiva.com/16287/acsa56-41cgkwa-f01-16287523.pdf?src-supplier=Future+Electronics; ComponentLink3Description: https://datasheet.ciiva.com/16287/acsa56-41cgkwa-f01-16287523.pdf?src-supplier=Future+Electronics; ComponentLink4URL: https://datasheet.ciiva.com/2103/acsa56-41cgkwa-f01-2103795.pdf?src-supplier=Digi-Key; ComponentLink4Description: https://datasheet.ciiva.com/2103/acsa56-41cgkwa-f01-2103795.pdf?src-supplier=Digi-Key; ComponentLink5URL: https://datasheet.ciiva.com/2103/acsa56-41cgkwa-f01-2103796.pdf?src-supplier=Digi-Key; ComponentLink5Description: https://datasheet.ciiva.com/2103/acsa56-41cgkwa-f01-2103796.pdf?src-supplier=Digi-Key
Q1-Q4 = SSM3J133TU: MOSFET P-CH 20V 4.4A UFM; Mfr_Name: Toshiba Electronic Devices & Storage Corp.; Type: DEV; Copyright: Copyright (C) 2022 Ultra Librarian. All rights reserved.; Manufacturer_Part_Number: SSM3J133TU; Digi-Key_Part_Number_1: SSM3J133TULFCT-ND; Digi-Key_Part_Number_2: SSM3J133TULFDKR-ND; Digi-Key_Part_Number_3: SSM3J133TULFTR-ND; RefDes: RefDes; Supplier 1: Digi-Key; Supplier Part Number 1: SSM3J133TULFCT-ND
R1-R4 = RES_0805_K_010.00: RES SMD 10K OHM 1% 1/8W 0805; Manufacturer 1: Yageo; Manufacturer Part Number 1: RC0805FR-0710KL; Temperature Coefficient: 100ppm/°C; Power Rating: 125mW; Voltage Rating: 150V; Resistance: 10kR; Supplier 1: Digi-Key; Supplier Part Number 1: 311-10.0KCRCT-ND; Stock 1: 7562122; Pricing 1: 1=0.10000, 10=0.04200, 100=0.01690, 1000=0.00759, 2500=0.00659 (USD); RoHS: Yes; Case/Package: 0805; Case Code (Imperial): 0805; Case Code (Metric): 2012; Min Operating Temperature: -55°C; Max Operating Temperature: 155°C; Tolerance: 1%; Packaging: Tape and Reel; Features: Moisture Resistant; Termination: SMD/SMT; Number of Terminations: 2; Military Standard: Not; Max Power Dissipation: 125mW; Package Quantity: 1; Length: 2mm; Height: 0.024inch; Width: 0.049inch; Depth: 1.25mm; Lead Free: Lead Free; REACH SVHC: Unknown; ComponentLink1URL: https://datasheet.ciiva.com/11808/0900766b8106beab-11808151.pdf?src-supplier=RSComponents; ComponentLink1Description: https://datasheet.ciiva.com/11808/0900766b8106beab-11808151.pdf?src-supplier=RSComponents; ComponentLink2URL: https://datasheet.ciiva.com/12669/rc0805-12669688.pdf?src-supplier=Mouser; ComponentLink2Description: https://datasheet.ciiva.com/12669/rc0805-12669688.pdf?src-supplier=Mouser; ComponentLink3URL: https://datasheet.ciiva.com/46447/444164-46447563.pdf?src-supplier=Element14; ComponentLink3Description: https://datasheet.ciiva.com/46447/444164-46447563.pdf?src-supplier=Element14; ComponentLink4URL: https://datasheet.ciiva.com/2456/pyu-r-int-thick-7-2456972.pdf?src-supplier=Digi-Key; ComponentLink4Description: https://datasheet.ciiva.com/2456/pyu-r-int-thick-7-2456972.pdf?src-supplier=Digi-Key; ComponentLink5URL: https://datasheet.ciiva.com/2456/pyu-r-int-thick-7-2456973.pdf?src-supplier=Digi-Key; ComponentLink5Description: https://datasheet.ciiva.com/2456/pyu-r-int-thick-7-2456973.pdf?src-supplier=Digi-Key; ComponentLink6URL: https://datasheet.ciiva.com/2456/pyu-r-int-thick-7-2456974.pdf?src-supplier=Digi-Key; ComponentLink6Description: https://datasheet.ciiva.com/2456/pyu-r-int-thick-7-2456974.pdf?src-supplier=Digi-Key; ComponentLink7URL: https://datasheet.ciiva.com/16747/rc0805-16747087.pdf?src-supplier=Future+Electronics; ComponentLink7Description: https://datasheet.ciiva.com/16747/rc0805-16747087.pdf?src-supplier=Future+Electronics; Category: Chip SMD Resistors; Size Code: 0805; Resistor Type: Thick Film; Series: RC; Construction: Rectangular; Resistance Tolerance: 1%; Technology: THICK FILM; RoHS Compliant: Yes

## Sheet 04_Seven_Seg.SchDoc: ECE315 Analog
size A; Date: 4/25/2017; ApprovedBy: JSK; CheckedBy: JSK; Author: JSK; CompanyName: University of Wisconsin; DrawnBy: JSK; Engineer: JSK; Organization: ECE 315; Address1: College of Engineering; Address2: 1415 Engineering Drive; Address3: Madison, WI 53706; Address4: ECE 315 Fall 2017; Revision: A; SheetNumber: 4; SheetTotal: 11; AssemblyNumber: ECE315-F19; ApprovedDate: 04/02/2019
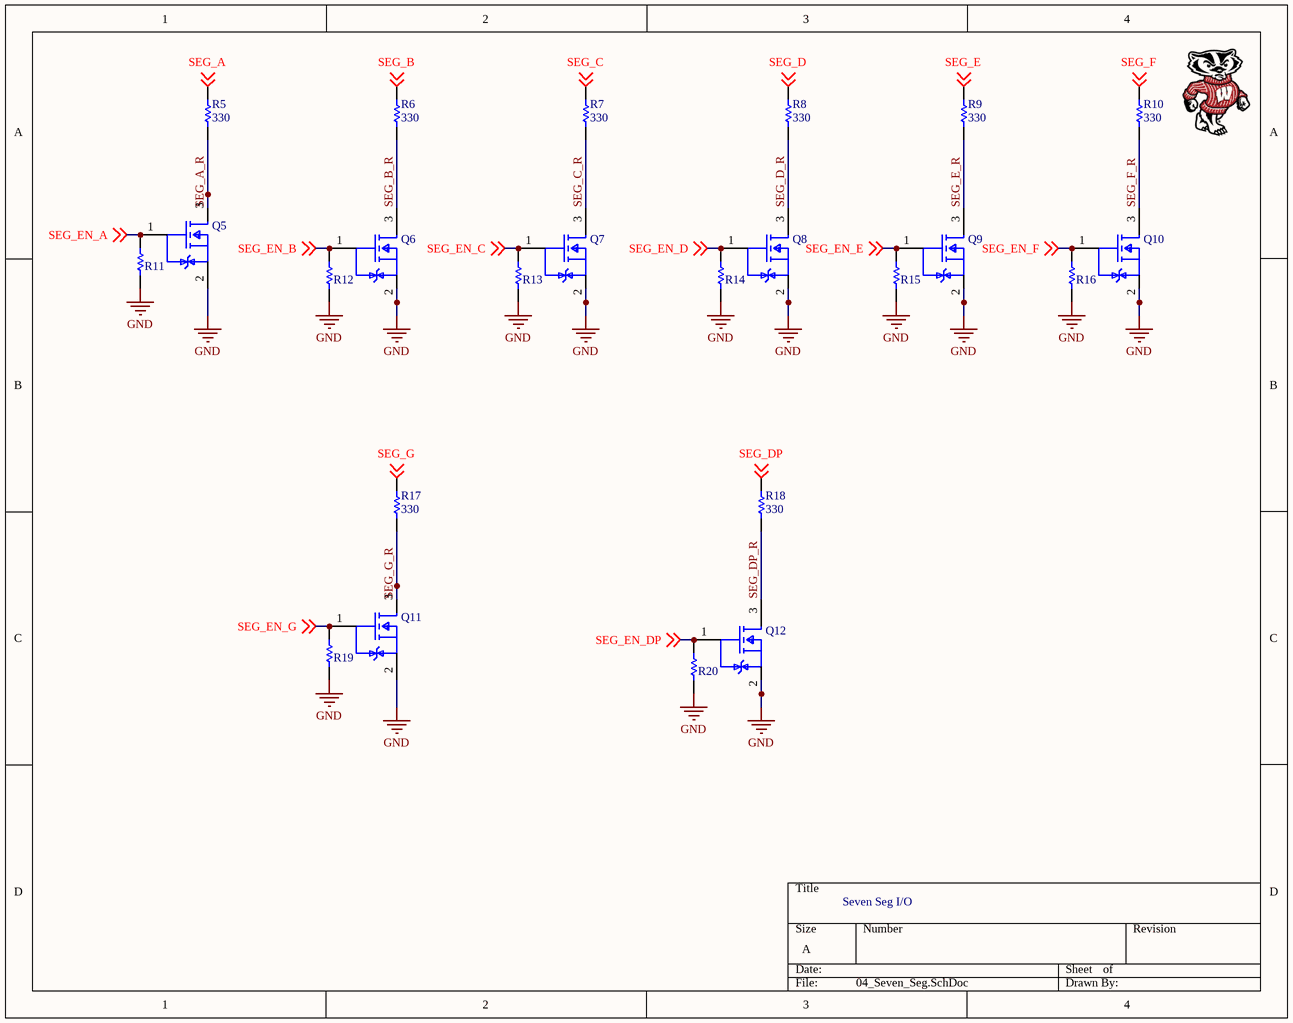
[diagram p3: 04_Seven_Seg.SchDoc]

### Parts
Q5  SSM3K329R,LF  [FP-2-3Z1A-MFG]  (value not drawn)
Q6  SSM3K329R,LF  [FP-2-3Z1A-MFG]  (value not drawn)
Q7  SSM3K329R,LF  [FP-2-3Z1A-MFG]  (value not drawn)
Q8  SSM3K329R,LF  [FP-2-3Z1A-MFG]  (value not drawn)
Q9  SSM3K329R,LF  [FP-2-3Z1A-MFG]  (value not drawn)
Q10  SSM3K329R,LF  [FP-2-3Z1A-MFG]  (value not drawn)
Q11  SSM3K329R,LF  [FP-2-3Z1A-MFG]  (value not drawn)
Q12  SSM3K329R,LF  [FP-2-3Z1A-MFG]  (value not drawn)
R5  330  [RES_0805]
R6  330  [RES_0805]
R7  330  [RES_0805]
R8  330  [RES_0805]
R9  330  [RES_0805]
R10  330  [RES_0805]
R11  RES_0805_K_010.00  [RES_0805]  (value not drawn)
R12  RES_0805_K_010.00  [RES_0805]  (value not drawn)
R13  RES_0805_K_010.00  [RES_0805]  (value not drawn)
R14  RES_0805_K_010.00  [RES_0805]  (value not drawn)
R15  RES_0805_K_010.00  [RES_0805]  (value not drawn)
R16  RES_0805_K_010.00  [RES_0805]  (value not drawn)
R17  330  [RES_0805]
R18  330  [RES_0805]
R19  RES_0805_K_010.00  [RES_0805]  (value not drawn)
R20  RES_0805_K_010.00  [RES_0805]  (value not drawn)

### Nets
GND: Q5.2(SOURCE) Q6.2(SOURCE) Q7.2(SOURCE) Q8.2(SOURCE) Q9.2(SOURCE) Q10.2(SOURCE) Q11.2(SOURCE) Q12.2(SOURCE) R11.1 R12.1 R13.1 R14.1 R15.1 R16.1 R19.1 R20.1
SEG_A: R5.2 ; off-sheet SEG_A
SEG_A_R: Q5.3(DRAIN) R5.1
SEG_B: R6.2 ; off-sheet SEG_B
SEG_B_R: Q6.3(DRAIN) R6.1
SEG_C: R7.2 ; off-sheet SEG_C
SEG_C_R: Q7.3(DRAIN) R7.1
SEG_D: R8.2 ; off-sheet SEG_D
SEG_D_R: Q8.3(DRAIN) R8.1
SEG_DP: R18.2 ; off-sheet SEG_DP
SEG_DP_R: Q12.3(DRAIN) R18.1
SEG_E: R9.2 ; off-sheet SEG_E
SEG_E_R: Q9.3(DRAIN) R9.1
SEG_EN_A: Q5.1(GATE) R11.2 ; off-sheet SEG_EN_A
SEG_EN_B: Q6.1(GATE) R12.2 ; off-sheet SEG_EN_B
SEG_EN_C: Q7.1(GATE) R13.2 ; off-sheet SEG_EN_C
SEG_EN_D: Q8.1(GATE) R14.2 ; off-sheet SEG_EN_D
SEG_EN_DP: Q12.1(GATE) R20.2 ; off-sheet SEG_EN_DP
SEG_EN_E: Q9.1(GATE) R15.2 ; off-sheet SEG_EN_E
SEG_EN_F: Q10.1(GATE) R16.2 ; off-sheet SEG_EN_F
SEG_EN_G: Q11.1(GATE) R19.2 ; off-sheet SEG_EN_G
SEG_F: R10.2 ; off-sheet SEG_F
SEG_F_R: Q10.3(DRAIN) R10.1
SEG_G: R17.2 ; off-sheet SEG_G
SEG_G_R: Q11.3(DRAIN) R17.1

### Notes on the sheet
- Seven Seg I/O

### Library data of the parts
Q5-Q12 = CMP-35916-000013-1: MOSFET N CH 30V 3.5A 2-3Z1A; Gate to Source Voltage (Vgs): 12V; Input Capacitance: 123pF; Drain to Source Resistance: 290mR; Rds On Max: 126mR; Max Power Dissipation: 1W; Continuous Drain Current (ID): 3.5A; Mount: Surface Mount; Case/Package: SOT-23-3; Drain to Source Breakdown Voltage: 30V; Packaging: Tape and Reel; Drain to Source Voltage (Vdss): 30V; Power Dissipation: 1W; Package Quantity: 3000
R5-R10 R17 R18 = RES_0805_R_330.00: RES 330 OHM 1% 1/8W 0805; Manufacturer 1: Stackpole Electronics; Manufacturer Part Number 1: RMCF0805FT330R; Temperature Coefficient: 100ppm/°C; Resistance: 330R; Max Power Dissipation: 125mW; Features: Automotive AEC-Q200; Number of Terminations: 2; RoHS: Yes; Packaging: Tape and Reel; Tolerance: 1%; Category: Chip SMD Resistors; Supplier 1: Digi-Key; Supplier Part Number 1: RMCF0805FT330RCT-ND; Stock 1: 205996; Pricing 1: 1=0.10000, 10=0.02700, 100=0.01090, 1000=0.00488, 2500=0.00423 (USD); Mount: Surface Mount; Case/Package: 0805; Case Code (Metric): 2012; Case Code (Imperial): 0805; Contact Plating: Tin,Matte; Min Operating Temperature: -55°C; Max Operating Temperature: 155°C; Resistor Type: Thick Film; Series: RMCF; Construction: Rectangular; Length: 0.079inch; Width: 0.049inch; Height: 0.026inch; Depth: 1.25mm; Radiation Hardening: No; Military Standard: Not; Lead Free: Lead Free; RoHS Compliant: Yes; ComponentLink1URL: http://components.arrow.com/part/dataview/40963487S9848862N1174?src-supplier=Arrow+Electronics; ComponentLink1Description: http://components.arrow.com/part/dataview/40963487S9848862N1174?src-supplier=Arrow+Electronics; ComponentLink2URL: https://www.seielect.com/catalog/SEI-RMCF_RMCP.pdf?src-supplier=Avnet; ComponentLink2Description: https://www.seielect.com/catalog/SEI-RMCF_RMCP.pdf?src-supplier=Avnet; ComponentLink3URL: https://www.seielect.com/Catalog/SEI-RMCF_RMCP.pdf?src-supplier=Digi-Key; ComponentLink3Description: https://www.seielect.com/Catalog/SEI-RMCF_RMCP.pdf?src-supplier=Digi-Key; ComponentLink4URL: https://www.seielect.com/catalog/SEI-Packaging.pdf?src-supplier=Digi-Key; ComponentLink4Description: https://www.seielect.com/catalog/SEI-Packaging.pdf?src-supplier=Digi-Key; ComponentLink5URL: https://www.verical.com/server-webapp/html/getDatasheet?partID=559884&src-supplier=Verical; ComponentLink5Description: https://www.verical.com/server-webapp/html/getDatasheet?partID=559884&src-supplier=Verical
R11-R16 R19 R20 = RES_0805_K_010.00: as R1 on sheet 03_Seven_Seg; Supplier 1: Digi-Key; Supplier Part Number 1: 311-10.0KCRCT-ND; Stock 1: 7562122; Pricing 1: 1=0.10000, 10=0.04200, 100=0.01690, 1000=0.00759, 2500=0.00659 (USD); RoHS: Yes; Case/Package: 0805; Case Code (Imperial): 0805; Case Code (Metric): 2012; Min Operating Temperature: -55°C; Max Operating Temperature: 155°C; Tolerance: 1%; Packaging: Tape and Reel; Features: Moisture Resistant; Termination: SMD/SMT; Number of Terminations: 2; Military Standard: Not; Max Power Dissipation: 125mW; Package Quantity: 1; Length: 2mm; Height: 0.024inch; Width: 0.049inch; Depth: 1.25mm; Lead Free: Lead Free; REACH SVHC: Unknown; ComponentLink1URL: https://datasheet.ciiva.com/11808/0900766b8106beab-11808151.pdf?src-supplier=RSComponents; ComponentLink1Description: https://datasheet.ciiva.com/11808/0900766b8106beab-11808151.pdf?src-supplier=RSComponents; ComponentLink2URL: https://datasheet.ciiva.com/12669/rc0805-12669688.pdf?src-supplier=Mouser; ComponentLink2Description: https://datasheet.ciiva.com/12669/rc0805-12669688.pdf?src-supplier=Mouser; ComponentLink3URL: https://datasheet.ciiva.com/46447/444164-46447563.pdf?src-supplier=Element14; ComponentLink3Description: https://datasheet.ciiva.com/46447/444164-46447563.pdf?src-supplier=Element14; ComponentLink4URL: https://datasheet.ciiva.com/2456/pyu-r-int-thick-7-2456972.pdf?src-supplier=Digi-Key; ComponentLink4Description: https://datasheet.ciiva.com/2456/pyu-r-int-thick-7-2456972.pdf?src-supplier=Digi-Key; ComponentLink5URL: https://datasheet.ciiva.com/2456/pyu-r-int-thick-7-2456973.pdf?src-supplier=Digi-Key; ComponentLink5Description: https://datasheet.ciiva.com/2456/pyu-r-int-thick-7-2456973.pdf?src-supplier=Digi-Key; ComponentLink6URL: https://datasheet.ciiva.com/2456/pyu-r-int-thick-7-2456974.pdf?src-supplier=Digi-Key; ComponentLink6Description: https://datasheet.ciiva.com/2456/pyu-r-int-thick-7-2456974.pdf?src-supplier=Digi-Key; ComponentLink7URL: https://datasheet.ciiva.com/16747/rc0805-16747087.pdf?src-supplier=Future+Electronics; ComponentLink7Description: https://datasheet.ciiva.com/16747/rc0805-16747087.pdf?src-supplier=Future+Electronics; Category: Chip SMD Resistors; Size Code: 0805; Resistor Type: Thick Film; Series: RC; Construction: Rectangular; Resistance Tolerance: 1%; Technology: THICK FILM; RoHS Compliant: Yes

## Sheet 05-SD_Card.SchDoc: ECE453 Power
size A; Date: 4/25/2017; ApprovedBy: JSK; CheckedBy: JSK; Author: JSK; CompanyName: University of Wisconsin; DrawnBy: JSK; Engineer: JSK; Organization: ECE 315; Address1: College of Engineering; Address2: 1415 Engineering Drive; Address3: Madison, WI 53706; Address4: ECE 453 Fall 2022; Revision: A; SheetNumber: 5; SheetTotal: 10; AssemblyNumber: ECE453-F22-01
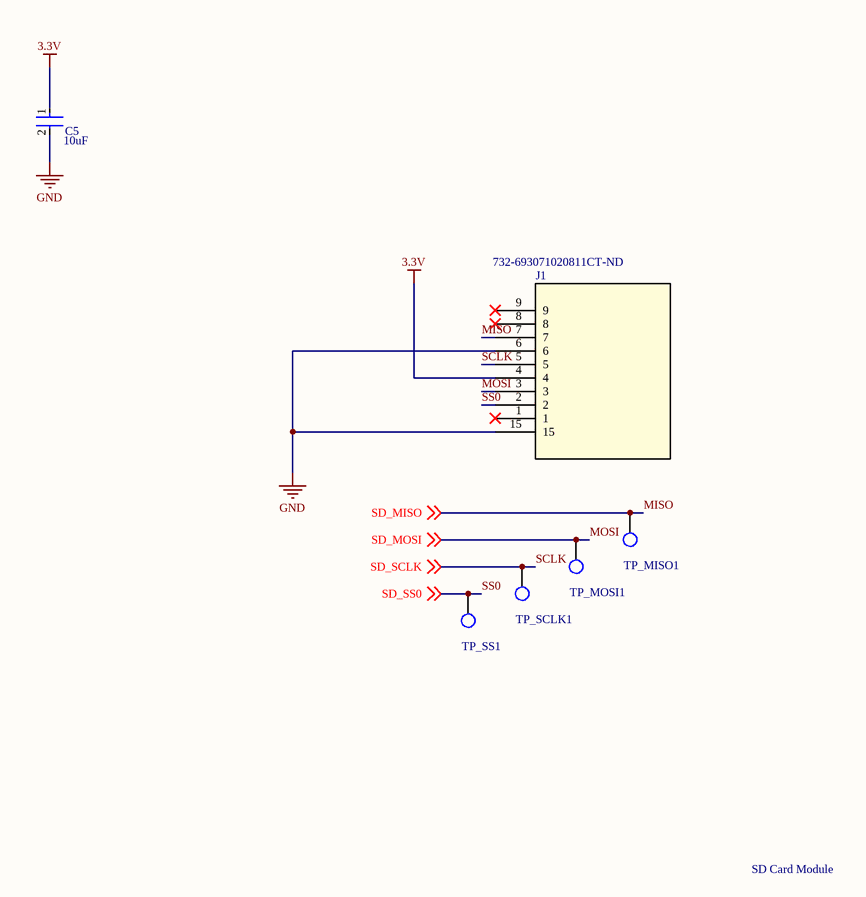
[diagram p4: 05-SD_Card.SchDoc]

### Parts
C5  Capacitance: 10uF  [FP-CL21-IPC_B]  (hidden comment: CL21A106KQCLNNC)
J1  Supplier Part Number 1: 732-693071020811CT-ND  [CONN9_020811_WRE]
TP_MISO1  TP_1206  [TP-SMC-1206]  (value not drawn)
TP_MOSI1  TP_1206  [TP-SMC-1206]  (value not drawn)
TP_SCLK1  TP_1206  [TP-SMC-1206]  (value not drawn)
TP_SS1  TP_1206  [TP-SMC-1206]  (value not drawn)

### Nets
3.3V: C5.1 J1.4
GND: C5.2 J1.6 J1.15
MISO: J1.7 TP_MISO1.1 ; off-sheet SD_MISO  [also labelled SD_MISO]
MOSI: J1.3 TP_MOSI1.1 ; off-sheet SD_MOSI  [also labelled SD_MOSI]
SCLK: J1.5 TP_SCLK1.1 ; off-sheet SD_SCLK  [also labelled SD_SCLK]
SS0: J1.2 TP_SS1.1 ; off-sheet SD_SS0  [also labelled SD_SS0]

Not connected (* = marked no-connect by the designer): J1 1* 8* 9*

### Notes on the sheet
- SD Card Module

### Library data of the parts
C5 = CMP-13271-003047-1: as C1 on sheet 03_Seven_Seg; Lead Free: Lead Free; Mount: Surface Mount; Case/Package: 0805; Packaging: Tape and Reel; Max Operating Temperature: 85°C; Min Operating Temperature: -55°C; Voltage Rating: 6.3V; Case Code (Metric): 2012; Radiation Hardening: No; Tolerance: 10%; Package Quantity: 1; Depth: 1.25mm; Width: 0.049inch; Dielectric: X5R; Height: 0.85mm; Case Code (Imperial): 0805; Length: 2mm; Thickness: 0.037inch
J1 = 693071020811: No Description Available; Mfr_Name: Wurth Electronics; Copyright: Copyright (C) 2022 Ultra Librarian. All rights reserved.; Manufacturer_Part_Number: 693071020811; Digi-Key_Part_Number_1: 732-693071020811TR-ND; Digi-Key_Part_Number_2: 732-693071020811CT-ND; Digi-Key_Part_Number_3: 732-693071020811DKR-ND; RefDes: RefDes; Type: DEV; Supplier 1: Digi-Key
TP_MISO1 TP_MOSI1 TP_SCLK1 TP_SS1 = TP_1206: Test Point SMD 1206; Manufacturer: TE Connectivity (Tyco Electronics); Manufacturer Part Number: 1625854-1; Resistance Value: 0 Ohm; Temperature Coefficient: N/R; Supplier: Digi-Key; Stock 1: 31937; Pricing 1: 1=0.28, 10=0.261, 25=0.224, 50=0.1902, 100=0.1828, 250=0.1641, 500=0.1567, 1000=0.1306 (USD); Case Size: 1206; Dimension: 3.2 x 1.6 x 1.25mm; Family: RC; Mounting: Surface Mount; Operating Temperature: -55 to 125 C; Part No: 1625854-1; RoHS: Yes; Packaging: Tape and Reel; Termination Style: N/R; Terminal Pitch: N/R; Power Rating: N/R; Tolerance: N/R; ComponentLink1URL: https://datasheet.ciiva.com/6439/eng-ds-1773266-a-6439169.pdf; ComponentLink1Description: https://datasheet.ciiva.com/6439/eng-ds-1773266-a-6439169.pdf; ComponentLink2URL: https://datasheet.ciiva.com/30136/1773266-a-30136341.pdf; ComponentLink2Description: https://datasheet.ciiva.com/30136/1773266-a-30136341.pdf; ComponentLink3URL: https://datasheet.ciiva.com/6439/eng-ds-1773266-a-6439080.pdf; ComponentLink3Description: https://datasheet.ciiva.com/6439/eng-ds-1773266-a-6439080.pdf; ComponentLink4URL: https://datasheet.ciiva.com/6439/eng-ds-1773266-a-6439081.pdf; ComponentLink4Description: https://datasheet.ciiva.com/6439/eng-ds-1773266-a-6439081.pdf; ComponentLink5URL: https://datasheet.ciiva.com/6439/eng-ds-1773266-a-6439083.pdf; ComponentLink5Description: https://datasheet.ciiva.com/6439/eng-ds-1773266-a-6439083.pdf; Supplier Part Number: A106143CT-ND; Supplier 1: Digi-Key; Supplier Part Number 1: A106143CT-ND